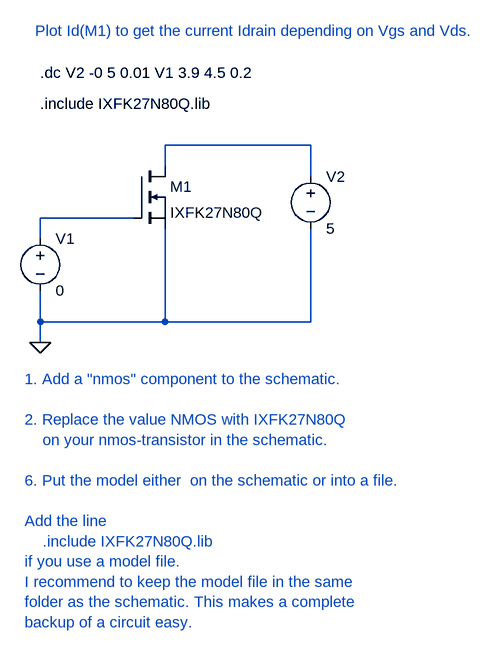
[diagram p0: schematic IXFK27N80Q_test.asc]
IXFK27N80Q_test.asc, the LTspice schematic file:
Version 4
SHEET 1 1512 988
WIRE -448 272 -448 240
WIRE -448 400 -448 352
WIRE -448 432 -448 400
WIRE -304 240 -448 240
WIRE -256 160 -256 128
WIRE -256 400 -448 400
WIRE -256 400 -256 256
WIRE -32 128 -256 128
WIRE -32 176 -32 128
WIRE -32 400 -256 400
WIRE -32 400 -32 256
FLAG -448 432 0
SYMBOL voltage -448 256 R0
SYMATTR InstName V1
SYMATTR Value 0
SYMBOL voltage -32 160 R0
SYMATTR InstName V2
SYMATTR Value 5
SYMBOL nmos -304 160 R0
SYMATTR InstName M1
SYMATTR Value IXFK27N80Q
TEXT -448 16 Left 0 !.dc V2 -0 5 0.01 V1 3.9 4.5 0.2
TEXT -472 488 Left 0 ;1. Add a "nmos" component to the schematic.\n \n2. Replace the value NMOS with IXFK27N80Q\n    on your nmos-transistor in the schematic.\n \n6. Put the model either  on the schematic or into a file.\n \nAdd the line  \n    .include IXFK27N80Q.lib\nif you use a model file. \nI recommend to keep the model file in the same \nfolder as the schematic. This makes a complete\nbackup of a circuit easy.
TEXT -448 64 Left 0 !.include IXFK27N80Q.lib
TEXT -456 -48 Left 0 ;Plot Id(M1) to get the current Idrain depending on Vgs and Vds.

The netlist it stands for:
* IXFK27N80Q_test.asc
V1 N001 0 0
V2 N002 0 5
M1 N002 N001 0 0 IXFK27N80Q
.model NMOS NMOS
.model PMOS PMOS
.lib standard.mos
.dc V2 -0 5 0.01 V1 3.9 4.5 0.2
* 1. Add a "nmos" component to the schematic.
* 2. Replace the value NMOS with IXFK27N80Q
*     on your nmos-transistor in the schematic.
* 6. Put the model either  on the schematic or into a file.
* Add the line
*     .include IXFK27N80Q.lib
* if you use a model file.
* I recommend to keep the model file in the same
* folder as the schematic. This makes a complete
* backup of a circuit easy.
.include IXFK27N80Q.lib
* Plot Id(M1) to get the current Idrain depending on Vgs and Vds.
.backanno
.end